# Altium schematic sheet pmic_tps51386_buck.SchDoc
size A
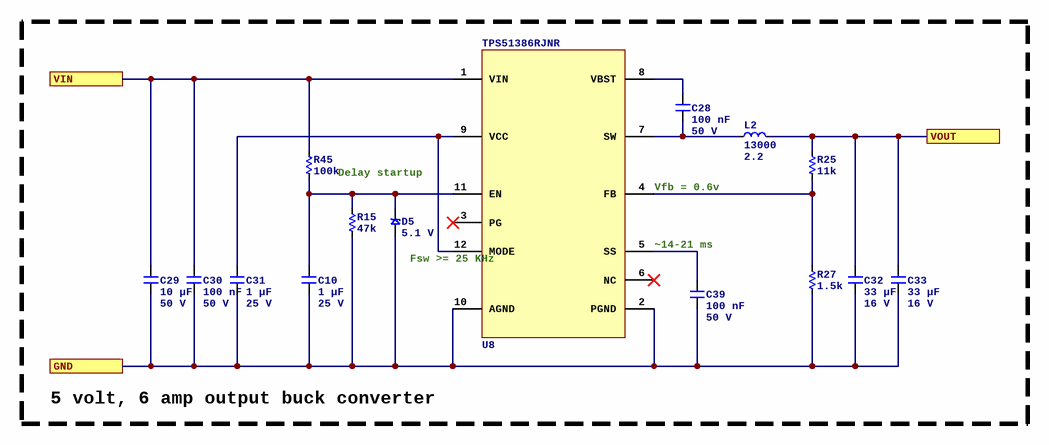
[diagram p0: pmic_tps51386_buck.SchDoc]

## Parts
C10  Capacitance: 1 µF  Voltage Rating: 25 V  [C0603]  (hidden comment: CL10B105KA8NNNC)
C28  Capacitance: 100 nF  Voltage Rating: 50 V  [C0402]  (hidden comment: CL05B104KB54PNC)
C29  Capacitance: 10 µF  Voltage Rating: 50 V  [C1206]  (hidden comment: CL31B106KBHNNNE)
C30  Capacitance: 100 nF  Voltage Rating: 50 V  [C0402]  (hidden comment: CL05B104KB54PNC)
C31  Capacitance: 1 µF  Voltage Rating: 25 V  [C0603]  (hidden comment: CL10B105KA8NNNC)
C32  Capacitance: 33 µF  Voltage Rating: 16 V  [C1812]  (hidden comment: C4532X7R1C336MT000N)
C33  Capacitance: 33 µF  Voltage Rating: 16 V  [C1812]  (hidden comment: C4532X7R1C336MT000N)
C39  Capacitance: 100 nF  Voltage Rating: 50 V  [C0402]  (hidden comment: CL05B104KB54PNC)
D5  Vr: 5.1 V  [SOD323]  (hidden comment: SZMM3Z5V1ST1G)
L2  Current Rating (mA): 13000  Inductance (µH): 2.2  [BOURNS_SRP7030CA]  (hidden comment: SRP7030CA-2R2M)
R15  value 47k  [R0402]  (hidden comment: 0402WGF4702TCE)
R25  value 11k  [R0402]  (hidden comment: 0402WGF1102TCE)
R27  value 1.5k  [R0402]  (hidden comment: 0402WGF1501TCE)
R45  value 100k  [R0402]  (hidden comment: 0402WGF1003TCE)
U8  TPS51386RJNR  [TI_RJN]

## Ports
GND, VIN, VOUT

## Nets
GND: C10.2 C29.2 C30.2 C31.2 C32.2 C33.2 C39.2 D5.1 R15.2 R27.2 U8.2(PGND) U8.10(AGND) ; port GND
VIN: C29.1 C30.1 R45.1 U8.1(VIN) ; port VIN
VOUT: C32.1 C33.1 L2.2 R25.2 ; port VOUT
NetC10_1: C10.1 D5.2 R15.1 R45.2 U8.11(EN)
NetC28_1: C28.1 U8.8(VBST)
NetC28_2: C28.2 L2.1 U8.7(SW)
NetC31_1: C31.1 U8.9(VCC) U8.12(MODE)
NetC39_1: C39.1 U8.5(SS)
NetR25_1: R25.1 R27.1 U8.4(FB)

Not connected (* = marked no-connect by the designer): U8 3(PG)* 6(NC)*

## Notes on the sheet
- Delay startup
- (near U8) Vfb = 0.6v
- (near U8) Fsw >= 25 KHz
- ~14-21 ms
- 5 volt, 6 amp output buck converter

## Library data of the parts
C10 C31 = CL10B105KA8NNNC: Manufacturer: Samsung Electro-Mechanics; Dielectric: X7R; ComponentLink1URL: https://wmsc.lcsc.com/wmsc/upload/file/pdf/v2/lcsc/2304140030_Samsung-Electro-Mechanics-CL10B105KA8NNNC_C29936.pdf; ComponentLink1Description: Datasheet; Manufacturer Part Number: CL10B105KA8NNNC; Package: 0603; Supplier 2: LCSC; Supplier Part Number 2: C29936
C28 C30 C39 = CL05B104KB54PNC: Manufacturer: Samsung Electro-Mechanics; Dielectric: X7R; ComponentLink1URL: https://wmsc.lcsc.com/wmsc/upload/file/pdf/v2/lcsc/2304140030_Samsung-Electro-Mechanics-CL05B104KB54PNC_C307331.pdf; ComponentLink1Description: Datasheet; Manufacturer Part Number: CL05B104KB54PNC; Package: 0402; Supplier 2: LCSC; Supplier Part Number 2: C307331
C29 = CL31B106KBHNNNE: Manufacturer: Samsung Electro-Mechanics; Dielectric: X7R; ComponentLink1URL: https://wmsc.lcsc.com/wmsc/upload/file/pdf/v2/lcsc/1810221111_Samsung-Electro-Mechanics-CL31B106KBHNNNE_C89632.pdf; ComponentLink1Description: Datasheet; Manufacturer Part Number: CL31B106KBHNNNE; Package: 1206; Supplier 2: LCSC; Supplier Part Number 2: C89632
C32 C33 = C4532X7R1C336MT000N: Manufacturer: TDK; Dielectric: X7R; ComponentLink1URL: https://wmsc.lcsc.com/wmsc/upload/file/pdf/v2/lcsc/2304140030_TDK-C4532X7R1C336MT000N_C342604.pdf; ComponentLink1Description: Datasheet; Manufacturer Part Number: C4532X7R1C336MT000N; Package: 1812; Supplier 2: LCSC; Supplier Part Number 2: C342604
D5 = SZMM3Z5V1ST1G: Zener Diode 5.1 V 300 mW ±2% Surface Mount SOD-323; Manufacturer: onsemi; Current: 58.8 mA; Supplier 1: DigiKey; Manufacturer Part Number: SZMM3Z5V1ST1G; ComponentLink1URL: https://www.onsemi.com/pdf/datasheet/mm3z2v4st1-d.pdf; ComponentLink1Description: Datasheet; Supplier Part Number 1: SZMM3Z5V1ST1GOSCT-ND; Supplier 2: LCSC; Supplier Part Number 2: C152524; Diode Type: Zener; Supplier 3: Mouser; Supplier Part Number 3: 863-SZMM3Z5V1ST1G
L2 = SRP7030CA-2R2M: 2.2 µH shielded power inductor; Manufacturer: BOURNS; DCR (mOhms): 13.7; Manufacturer Part Number: SRP7030CA-2R2M; ComponentLink1Description: Datasheet; ComponentLink1URL: https://www.bourns.com/docs/product-datasheets/SRP7030CA.pdf; Supplier 2: LCSC; Supplier Part Number 2: C1332137; Supplier 1: DigiKey; Supplier Part Number 1: SRP7030CA-2R2MCT-ND; Supplier 3: Mouser; Supplier Part Number 3: 652-SRP7030CA-2R2M
R15 = 0402WGF4702TCE: Manufacturer: UNI-ROYAL(Uniroyal Elec); Tolerance: 1%; Temperature Coefficient: ±100ppm/?; Power Rating (mW): 62.5; ComponentLink1Description: Datasheet; ComponentLink1URL: https://wmsc.lcsc.com/wmsc/upload/file/pdf/v2/lcsc/2206010100_UNI-ROYAL-Uniroyal-Elec-0402WGF4702TCE_C25792.pdf; Manufacturer Part Number: 0402WGF4702TCE; Package: 0402; Supplier 2: LCSC; Supplier Part Number 2: C25792
R25 = 0402WGF1102TCE: Manufacturer: UNI-ROYAL(Uniroyal Elec); Power Rating (mW): 62.5; Tolerance: 1%; Temperature Coefficient: ±100ppm/?; Manufacturer Part Number: 0402WGF1102TCE; Package: 0402; Supplier 2: LCSC; Supplier Part Number 2: C25749; ComponentLink1Description: Datasheet; ComponentLink1URL: https://wmsc.lcsc.com/wmsc/upload/file/pdf/v2/lcsc/2206010100_UNI-ROYAL-Uniroyal-Elec-0402WGF1102TCE_C25749.pdf
R27 = 0402WGF1501TCE: Manufacturer: UNI-ROYAL(Uniroyal Elec); Tolerance: 1%; Temperature Coefficient: ±100ppm/?; Power Rating (mW): 62.5; ComponentLink1Description: Datasheet; ComponentLink1URL: https://wmsc.lcsc.com/wmsc/upload/file/pdf/v2/lcsc/2206010045_UNI-ROYAL-Uniroyal-Elec-0402WGF1501TCE_C25867.pdf; Manufacturer Part Number: 0402WGF1501TCE; Package: 0402; Supplier 2: LCSC; Supplier Part Number 2: C25867
R45 = 0402WGF1003TCE: Manufacturer: UNI-ROYAL(Uniroyal Elec); Tolerance: 1%; Temperature Coefficient: ±100ppm/?; Power Rating (mW): 62.5; ComponentLink1Description: Datasheet; ComponentLink1URL: https://wmsc.lcsc.com/wmsc/upload/file/pdf/v2/lcsc/2206010100_UNI-ROYAL-Uniroyal-Elec-0402WGF1003TCE_C25741.pdf; Manufacturer Part Number: 0402WGF1003TCE; Package: 0402; Supplier 2: LCSC; Supplier Part Number 2: C25741
U8 = TPS51386RJNR: Buck Switching Regulator IC Positive Adjustable 0.6V 1 Output 8A 12-PowerVFQFN; Manufacturer: Texas Instruments; Supplier 2: LCSC; Supplier Part Number 2: C22388893; Manufacturer Part Number: TPS51386RJNR; Supplier 1: DigiKey; Supplier Part Number 1: 296-TPS51386RJNRCT-ND; Supplier 3: Mouser; Supplier Part Number 3: 595-TPS51386RJNR; ComponentLink1Description: Datasheet; ComponentLink1URL: https://www.ti.com/lit/ds/symlink/tps51386.pdf